# Altium schematic sheet M24C02.SchDoc
size A4
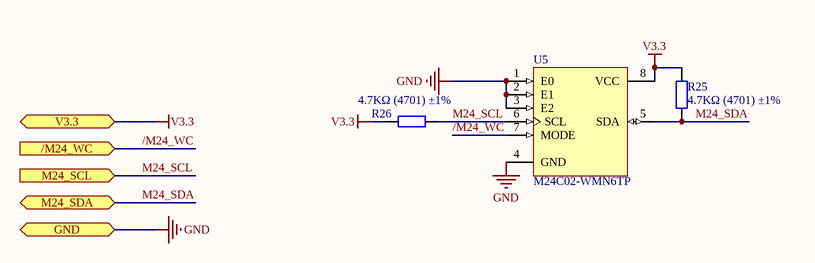
[diagram p0: M24C02.SchDoc]

## Parts
R25  4.7KΩ (4701) ±1%  [0805_R]
R26  4.7KΩ (4701) ±1%  [0805_R]
U5  M24C02-WMN6TP  [SOIC-8_150mil]

## Ports
/M24_WC (in), GND, M24_SCL (in), M24_SDA, V3.3

## Nets
GND: U5.1(E0) U5.2(E1) U5.3(E2) U5.4(GND) ; port GND
V3.3: R25.2 R26.2 U5.8(VCC) ; port V3.3
/M24_WC: U5.7(MODE) ; port /M24_WC
M24_SCL: R26.1 U5.6(SCL) ; port M24_SCL
M24_SDA: R25.1 U5.5(SDA) ; port M24_SDA

## Library data of the parts
R25 R26 = 0805 4.7KΩ (4701) 1%: 贴片电阻; ComponentLink1Description: 供应商链接; ComponentLink1URL: http://www.szlcsc.com/product/details_18361.html; Package: 0805; Supplier: LC; SuppliersPartNumber: C17673
U5 = M24C02-WMN6TP_[C7562]: EEPROM; ComponentLink1Description: 供应商链接; ComponentLink1URL: http://www.szlcsc.com/product/details_8039.html; Package: SOIC-8_150mil; Supplier: LC; SuppliersPartNumber: C7562